# Altium schematic sheet mppt.SchDoc
size A
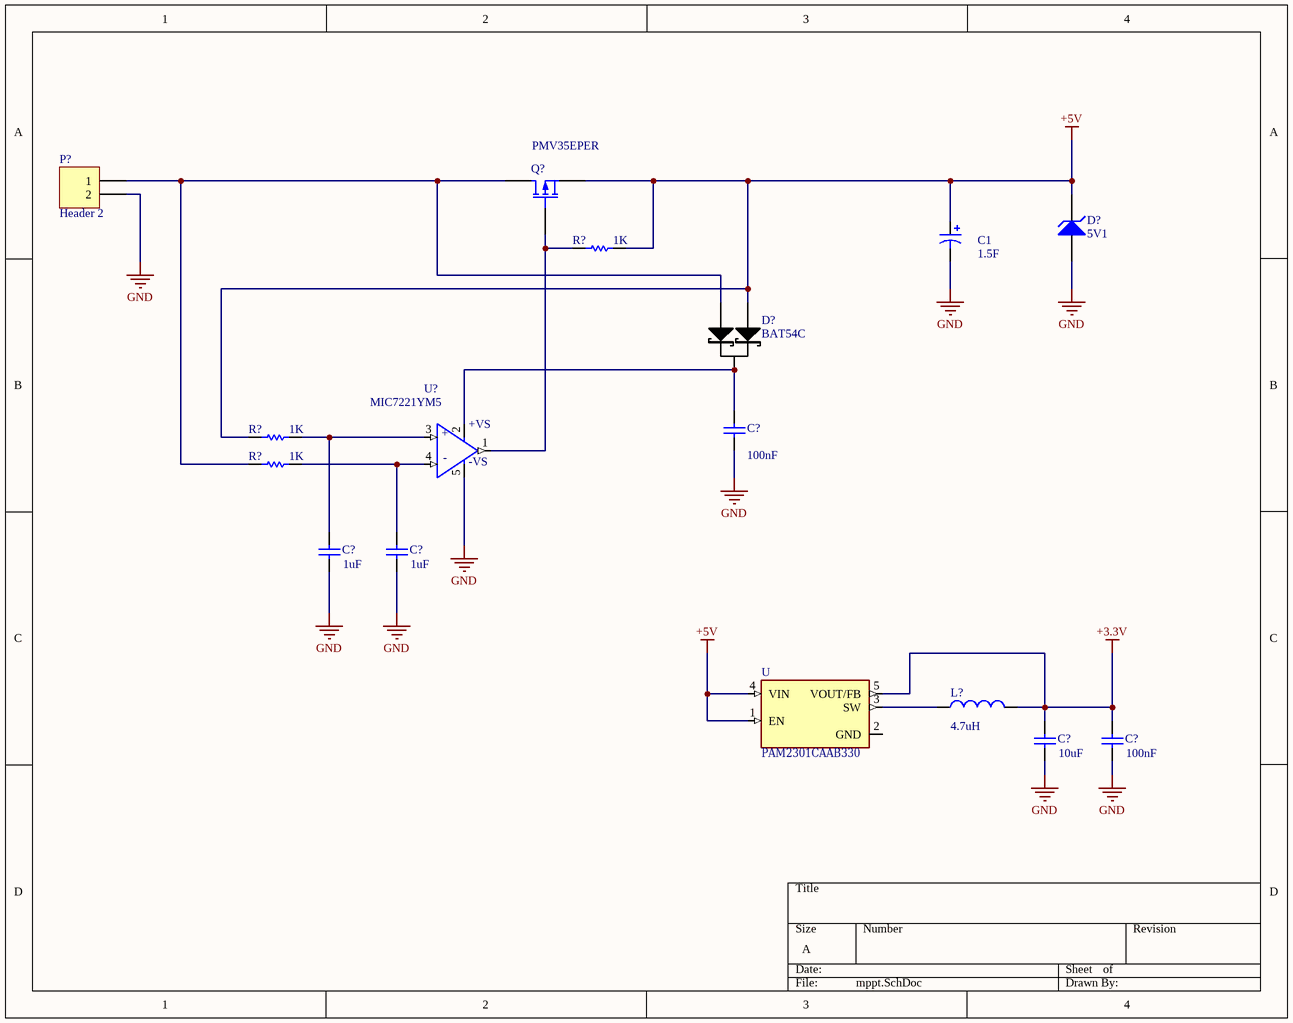
[diagram p0: mppt.SchDoc]

## Parts
(Parts that share a designator on the sheet are numbered #1, #2 ... from top to bottom, then left to right.)
C1  value 1.5F  [RB7.6-15]  (hidden comment: Cap Pol1)
C?#1  value 100nF  [6-0805_M]  (hidden comment: Cap)
C?#2  value 1uF  [6-0805_M]  (hidden comment: Cap)
C?#3  value 1uF  [6-0805_M]  (hidden comment: Cap)
C?#4  value 10uF  [6-0805_M]  (hidden comment: Cap)
C?#5  value 100nF  [6-0805_M]  (hidden comment: Cap)
D?#1  5V1  [DIODE-0.7]
D?#2  BAT54C  [SOT23-123]
L?  value 4.7uH  [0402-A]  (hidden comment: Inductor)
P?  Header 2  [HDR1X2]
Q?  PMV35EPER  [PMV35EPER]
R?#1  value 1K  [6-0805_N]  (hidden comment: Res1)
R?#2  value 1K  [6-0805_N]  (hidden comment: Res1)
R?#3  value 1K  [6-0805_N]  (hidden comment: Res1)
U  PAM2301CAAB330‎  [SOT95P280X100-5N]
U?  MIC7221YM5  [MIC7221YM5]

## Nets
+3.3V: C?#4.2 C?#5.2 L?.2 U.5(VOUT/FB)
+5V: C1.1 D?#1.2(K) D?#2.1 Q?.3(S) R?#1.2 R?#2.1 U.1(EN) U.4(VIN)
GND: C1.2 C?#1.1 C?#2.1 C?#3.1 C?#4.1 C?#5.1 D?#1.1(A) P?.2 U?.5(-VS)
NetC?#1_2: C?#1.2 D?#2.3 U?.2(+VS)
NetC?#2_2: C?#2.2 R?#2.2 U?.3(IN+)
NetC?#3_2: C?#3.2 R?#3.2 U?.4(IN-)
NetD?#2_2: D?#2.2 P?.1 Q?.1(D) R?#3.1
NetL?_1: L?.1 U.3(SW)
NetQ?_2: Q?.2(G) R?#1.1 U?.1(OUT)

Not connected (* = marked no-connect by the designer): U 2(GND)

## Notes on the sheet
- (in symbol MIC7221YM5-TR) +; -

## Library data of the parts
C1 = Cap Pol1: Polarized Capacitor (Radial); Published: 8-Jun-2000; LatestRevisionDate: 17-Jul-2002; LatestRevisionNote: Re-released for DXP Platform.; PackageReference: RB7.6-15; Publisher: Altium Limited; PackageDescription: Polarized Capacitor (Radial); 2 Leads
C?#1-C?#5 = Cap: Capacitor; Published: 8-Jun-2000; LatestRevisionDate: 17-Jul-2002; LatestRevisionNote: Re-released for DXP Platform.; PackageReference: RAD-0.3; Publisher: Altium Limited; PackageDescription: Radial Cap, Thru-Hole; 2 Leads; 0.3 in Pin Spacing
D?#1 = D Zener: Zener Diode; Published: 8-Jun-2000; LatestRevisionDate: 17-Jul-2002; LatestRevisionNote: Re-released for DXP Platform.; PackageReference: DIODE-0.7; Publisher: Altium Limited; PackageDescription: Diode, Thru-Hole; 2 Leads; 0.7 in Pin Spacing
D?#2 = BAT54C-SOT23: DUAL SCHOTTKY DIODE COMMON CATHODE; Manufacturer: NXP Semiconductors; Manufacturer Part Number: BAT54C,215; Reverse Recovery Time (trr): 5ns; Current - Average Rectified (Io) (per Diode): 200mA (DC); Speed: Small Signal =< 200mA (Io), Any Speed; Diode Configuration: 1 Pair Common Cathode; Voltage - DC Reverse (Vr) (Max): 30V; Current - Reverse Leakage @ Vr: 2µA @ 25V; Voltage - Forward (Vf) (Max) @ If: 800mV @ 100mA; Supplier 1: Digi-Key; Supplier Part Number 1: 568-1612-1-ND; Package / Case: SOT-23-3, TO-236-3, Micro3™, SSD3, SST3; Packaging: Cut Tape (CT); Mounting Type: Surface Mount; Diode Type: Schottky; Category: Discrete Semiconductor Products; RoHS: RoHS Compliant; Supplier Part Number: 568-1612-1-ND; Supplier: Digi-Key
L? = Inductor: Code_IEC: 1005; Published: 8-Jun-2000; LatestRevisionDate: 29-May-2009; LatestRevisionNote: IPC-7351 Footprint Added.; PackageReference: 0402-A; Publisher: Altium Limited; PackageDescription: Chip Inductor; Code_JEITA: 0402
P? = Header 2: Header, 2-Pin; LatestRevisionDate: 17-Jul-2002; LatestRevisionNote: Re-released for DXP Platform.; Publisher: Altium Limited
Q? = MOSFET-P: P-Channel MOSFET; Published: 8-Jun-2000; LatestRevisionDate: 17-Jul-2002; LatestRevisionNote: Re-released for DXP Platform.; PackageVersion: 1995/1996; PackageReference: E3; Publisher: Altium Limited; PackageDescription: TO, Flat Index; 3 In-Line, Axial Leads; Body Dia. 4.6mm; Lead Dia. 0.5 mm (max)
R?#1-R?#3 = Res1: Resistor; Published: 8-Jun-2000; LatestRevisionDate: 17-Jul-2002; LatestRevisionNote: Re-released for DXP Platform.; PackageReference: AXIAL-0.3; Publisher: Altium Limited; PackageDescription: Axial Device, Thru-Hole; 2 Leads; 0.3 in Pin Spacing
U = PAM2301CAAB120: Buck Switching Regulator IC Positive Fixed 1.2V 1 Output 800mA SOT-23-5 Thin, TSOT-23-5; MF: Diodes Inc.; SnapEDA_Link: https://www.snapeda.com/parts/PAM2301CAAB120/Diodes%20Inc./view-part/924331/?ref=snap; Availability: Unavailable; Value: *; Price: None; MP: PAM2301CAAB120; Package: SOT-23-5 Diodes Inc.
U? = MIC7221YM5-TR: Comparator General Purpose Open Drain SOT-23-5; MF: Microchip; Price: None; Availability: Unavailable; MP: MIC7221YM5-TR; Package: SOT-23 Microchip; SnapEDA_Link: https://www.snapeda.com/parts/MIC7221YM5-TR/Microchip/view-part/1222183/?ref=snap; Value: *